# Altium schematic sheet P_FET.SchDoc
size E
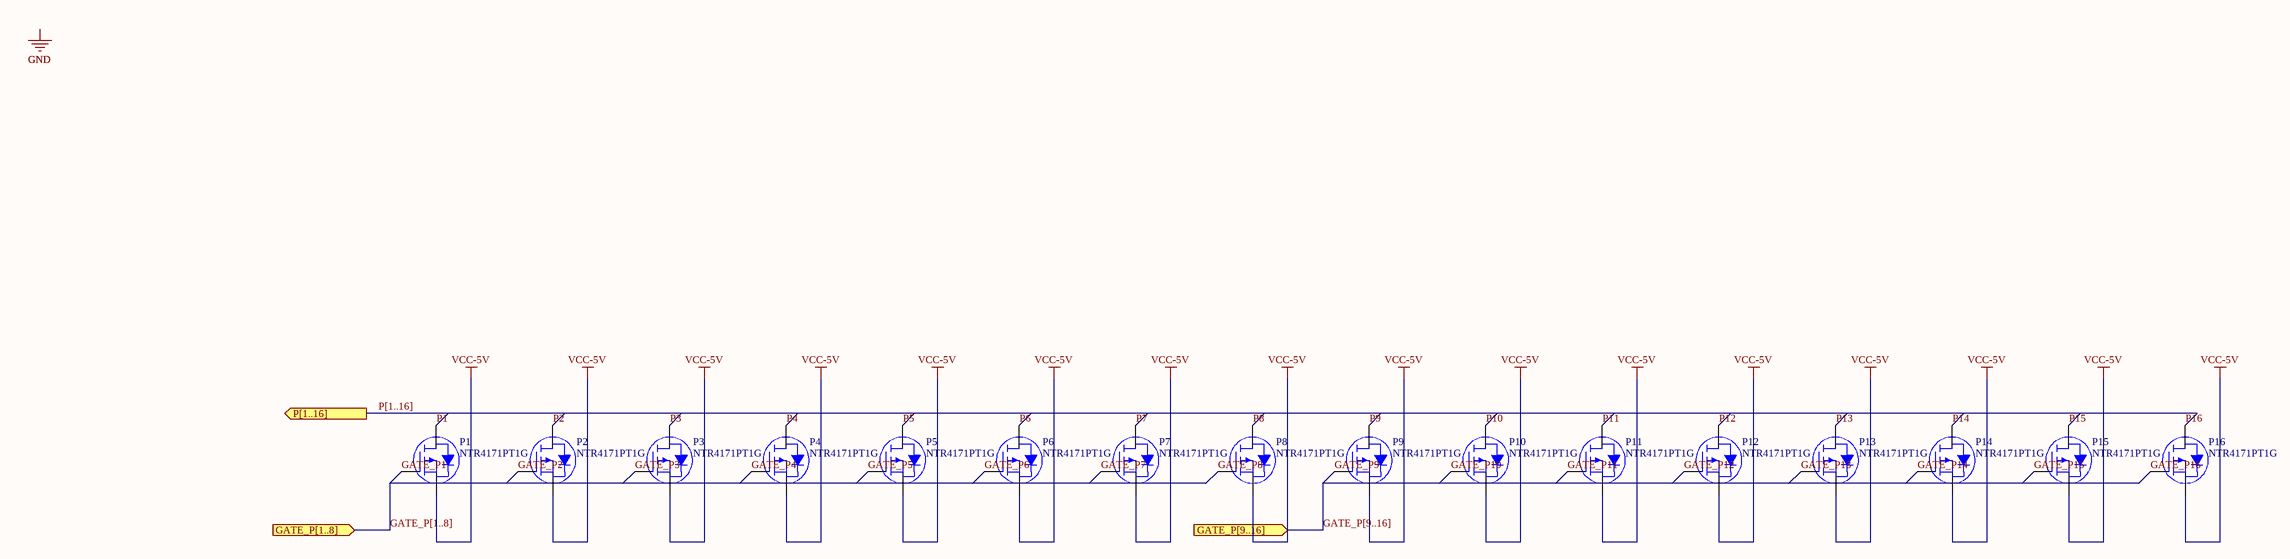
[diagram p0: P_FET.SchDoc]

## Parts
P1  NTR4171PT1G  [ON SEMI SOT-23-3]
P2  NTR4171PT1G  [ON SEMI SOT-23-3]
P3  NTR4171PT1G  [ON SEMI SOT-23-3]
P4  NTR4171PT1G  [ON SEMI SOT-23-3]
P5  NTR4171PT1G  [ON SEMI SOT-23-3]
P6  NTR4171PT1G  [ON SEMI SOT-23-3]
P7  NTR4171PT1G  [ON SEMI SOT-23-3]
P8  NTR4171PT1G  [ON SEMI SOT-23-3]
P9  NTR4171PT1G  [ON SEMI SOT-23-3]
P10  NTR4171PT1G  [ON SEMI SOT-23-3]
P11  NTR4171PT1G  [ON SEMI SOT-23-3]
P12  NTR4171PT1G  [ON SEMI SOT-23-3]
P13  NTR4171PT1G  [ON SEMI SOT-23-3]
P14  NTR4171PT1G  [ON SEMI SOT-23-3]
P15  NTR4171PT1G  [ON SEMI SOT-23-3]
P16  NTR4171PT1G  [ON SEMI SOT-23-3]

## Ports
GATE_P[1..8] (in), GATE_P[9..16] (in), P[1..16] (out)

## Nets
VCC-5V: P1.3(S) P2.3(S) P3.3(S) P4.3(S) P5.3(S) P6.3(S) P7.3(S) P8.3(S) P9.3(S) P10.3(S) P11.3(S) P12.3(S) P13.3(S) P14.3(S) P15.3(S) P16.3(S) ; port GATE_P[9..16]
GATE_P1: P1.1(G)
GATE_P2: P2.1(G)
GATE_P3: P3.1(G)
GATE_P4: P4.1(G)
GATE_P5: P5.1(G)
GATE_P6: P6.1(G)
GATE_P7: P7.1(G)
GATE_P8: P8.1(G)
GATE_P9: P9.1(G)
GATE_P10: P10.1(G)
GATE_P11: P11.1(G)
GATE_P12: P12.1(G)
GATE_P13: P13.1(G)
GATE_P14: P14.1(G)
GATE_P15: P15.1(G)
GATE_P16: P16.1(G)
P1: P1.2(D)
P2: P2.2(D)
P3: P3.2(D)
P4: P4.2(D)
P5: P5.2(D)
P6: P6.2(D)
P7: P7.2(D)
P8: P8.2(D)
P9: P9.2(D)
P10: P10.2(D)
P11: P11.2(D)
P12: P12.2(D)
P13: P13.2(D)
P14: P14.2(D)
P15: P15.2(D)
P16: P16.2(D)

## Buses and harness runs
bus GATE_P[1..8] = port GATE_P[1..8]
bus GATE_P[9..16]
bus P[1..16] = port P[1..16]

## Library data of the parts
P1-P16 = NTR4171PT1G: MOSFET P-CH 30V 2.2A SOT23; Manufacturer: ON Semiconductor; Rds On (Max) at Id, Vgs: 75 mOhm @ 2.2A, 10V; Vgs(th) (Max) at Id: 1.4V @ 250uA; Gate Charge (Qg): 15.6nC @ 10V; Input Capacitance (Ciss) at Vds: 720pF @ 15V; Power - Max: 480mW; Current Continuous Drain: 2.2A (Ta); Part Number: NTR4171PT1G; PartId: 8195; Supplier 1: Digi-Key; Supplier Part Number 1: NTR4171PT1GOSTR-ND; ComponentLink1Description: Datasheet; ComponentLink1URL: http://www.onsemi.com/pub_link/Collateral/NTR4171P-D.PDF; ComponentLink2Description: Digi-Key Listing; ComponentLink2URL: http://www.digikey.com/product-detail/en/NTR4171PT1G/NTR4171PT1GOSTR-ND/2050558; Price: .1024; Type: MOSFET P-Channel, Metal Oxide; Device Package: TO-236-3, SC-59, SOT-23-3; Drain to Source Voltage (Vdss): 30V; Features: Standard